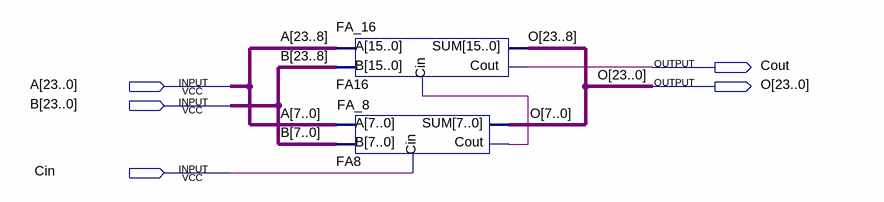
[diagram p0: schematic sheet]
// Quartus schematic FA_24.bdf as structural Verilog: 2 symbols, 5 pins
module FA_24 (
  input  [23:0] A,
  input  [23:0] B,
  input  Cin,
  output Cout,
  output [23:0] O
);

  wire FA8_cout;

  FA_16 FA16 (.Cin(FA8_cout), .A(A[23:8]), .B(B[23:8]), .SUM(O[23:8]), .Cout(Cout));
  FA_8 FA8 (.Cin(Cin), .A(A[7:0]), .B(B[7:0]), .SUM(O[7:0]), .Cout(FA8_cout));
endmodule
